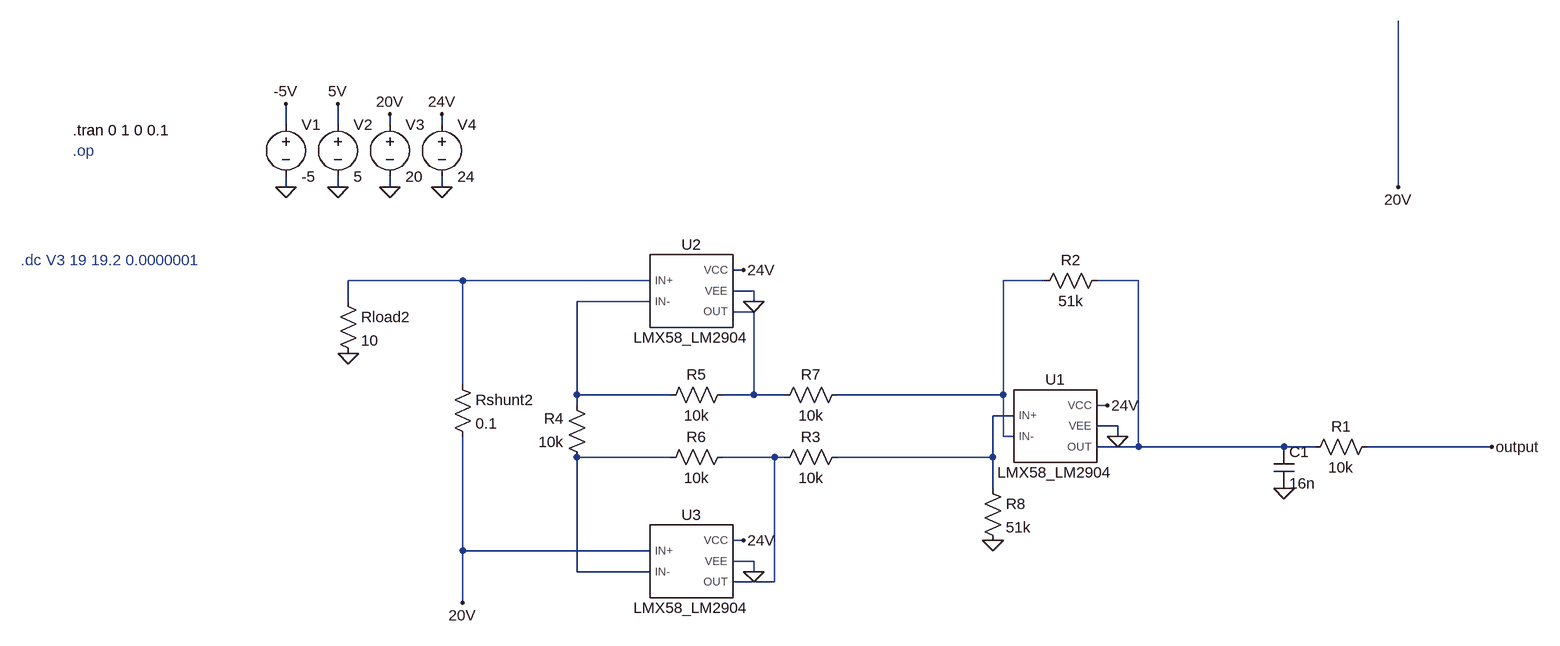
[diagram p0: schematic L358 ina.asc]
L358 ina.asc, the LTspice schematic file:
Version 4.1
SHEET 1 2016 1228
WIRE 64 400 64 368
WIRE 144 400 144 368
WIRE 224 400 224 384
WIRE 304 400 304 384
WIRE 64 496 64 480
WIRE 144 496 144 480
WIRE 224 496 224 480
WIRE 304 496 304 480
WIRE 1776 496 1776 240
WIRE 768 624 752 624
WIRE 336 640 160 640
WIRE 624 640 336 640
WIRE 1232 640 1168 640
WIRE 1376 640 1312 640
WIRE 784 656 752 656
WIRE 160 672 160 640
WIRE 624 672 512 672
WIRE 784 672 784 656
WIRE 784 688 752 688
WIRE 336 800 336 640
WIRE 512 816 512 672
WIRE 656 816 512 816
WIRE 784 816 784 688
WIRE 784 816 736 816
WIRE 832 816 784 816
WIRE 1168 816 1168 640
WIRE 1168 816 912 816
WIRE 512 832 512 816
WIRE 1328 832 1312 832
WIRE 1184 848 1152 848
WIRE 1344 864 1312 864
WIRE 1168 880 1168 816
WIRE 1184 880 1168 880
WIRE 1344 880 1344 864
WIRE 1376 896 1376 640
WIRE 1376 896 1312 896
WIRE 1600 896 1376 896
WIRE 1648 896 1600 896
WIRE 1920 896 1728 896
WIRE 656 912 512 912
WIRE 816 912 736 912
WIRE 832 912 816 912
WIRE 1152 912 1152 848
WIRE 1152 912 912 912
WIRE 1152 960 1152 912
WIRE 768 1040 752 1040
WIRE 336 1056 336 880
WIRE 624 1056 336 1056
WIRE 784 1072 752 1072
WIRE 512 1088 512 912
WIRE 624 1088 512 1088
WIRE 784 1088 784 1072
WIRE 816 1104 816 912
WIRE 816 1104 752 1104
WIRE 336 1136 336 1056
FLAG 1920 896 output
FLAG 1600 960 0
FLAG 144 368 5V
FLAG 64 368 -5V
FLAG 64 496 0
FLAG 144 496 0
FLAG 224 384 20V
FLAG 224 496 0
FLAG 1152 1040 0
FLAG 336 1136 20V
FLAG 1344 880 0
FLAG 784 672 0
FLAG 784 1088 0
FLAG 304 496 0
FLAG 304 384 24V
FLAG 768 624 24V
FLAG 768 1040 24V
FLAG 1328 832 24V
FLAG 1776 496 20V
FLAG 160 752 0
DATAFLAG 416 1056 ""
DATAFLAG 400 640 ""
DATAFLAG 1840 896 ""
DATAFLAG 1024 816 ""
DATAFLAG 1008 912 ""
SYMBOL voltage 64 384 R0
WINDOW 123 0 0 Left 0
WINDOW 39 0 0 Left 0
SYMATTR InstName V1
SYMATTR Value -5
SYMBOL voltage 144 384 R0
WINDOW 123 0 0 Left 0
WINDOW 39 0 0 Left 0
SYMATTR InstName V2
SYMATTR Value 5
SYMBOL voltage 224 384 R0
WINDOW 123 0 0 Left 0
WINDOW 39 0 0 Left 0
SYMATTR InstName V3
SYMATTR Value 20
SYMBOL LMX58_LM2904 1248 864 R0
SYMATTR InstName U1
SYMBOL res 1744 880 R90
WINDOW 0 0 56 VBottom 2
WINDOW 3 32 56 VTop 2
SYMATTR InstName R1
SYMATTR Value 10k
SYMBOL cap 1584 896 R0
SYMATTR InstName C1
SYMATTR Value 16n
SYMBOL res 1328 624 R90
WINDOW 0 0 56 VBottom 2
WINDOW 3 32 56 VTop 2
SYMATTR InstName R2
SYMATTR Value 51k
SYMBOL LMX58_LM2904 688 656 R0
SYMATTR InstName U2
SYMBOL LMX58_LM2904 688 1072 R0
SYMATTR InstName U3
SYMBOL res 928 896 R90
WINDOW 0 0 56 VBottom 2
WINDOW 3 32 56 VTop 2
SYMATTR InstName R3
SYMATTR Value 10k
SYMBOL res 528 928 R180
WINDOW 0 36 76 Left 2
WINDOW 3 36 40 Left 2
SYMATTR InstName R4
SYMATTR Value 10k
SYMBOL res 640 832 R270
WINDOW 0 32 56 VTop 2
WINDOW 3 0 56 VBottom 2
SYMATTR InstName R5
SYMATTR Value 10k
SYMBOL res 640 928 R270
WINDOW 0 32 56 VTop 2
WINDOW 3 0 56 VBottom 2
SYMATTR InstName R6
SYMATTR Value 10k
SYMBOL res 928 800 R90
WINDOW 0 0 56 VBottom 2
WINDOW 3 32 56 VTop 2
SYMATTR InstName R7
SYMATTR Value 10k
SYMBOL res 1136 944 R0
SYMATTR InstName R8
SYMATTR Value 51k
SYMBOL voltage 304 384 R0
WINDOW 123 0 0 Left 0
WINDOW 39 0 0 Left 0
SYMATTR InstName V4
SYMATTR Value 24
SYMBOL res 320 784 R0
SYMATTR InstName Rshunt2
SYMATTR Value 0.1
SYMBOL res 144 656 R0
SYMATTR InstName Rload2
SYMATTR Value 10
TEXT -264 408 Left 2 !.tran 0 1 0 0.1
TEXT -264 440 Left 2 ;.op
TEXT -344 608 Left 2 ;.dc V3 19 19.2 0.0000001

The netlist it stands for:
* L358 ina.asc
V1 -5V 0 -5
V2 5V 0 5
V3 20V 0 20
X§U1 N006 N002 24V 0 N003 LMX58_LM2904  ; pins IN+ IN- VCC VEE OUT
R1 output N003 10k
C1 N003 0 16n
R2 N003 N002 51k
X§U2 N001 N004 24V 0 N005 LMX58_LM2904  ; pins IN+ IN- VCC VEE OUT
X§U3 20V N007 24V 0 N008 LMX58_LM2904  ; pins IN+ IN- VCC VEE OUT
R3 N006 N008 10k
R4 N007 N004 10k
R5 N004 N005 10k
R6 N007 N008 10k
R7 N002 N005 10k
R8 N006 0 51k
V4 24V 0 24
Rshunt2 N001 20V 0.1
Rload2 N001 0 10
.tran 0 1 0 0.1
* .op
* .dc V3 19 19.2 0.0000001
.lib C:\Users\piken\Downloads\snom268c\lmx58_lm2904.lib
.backanno
.end